# Altium project Wilamp_DCU.PrjPCB
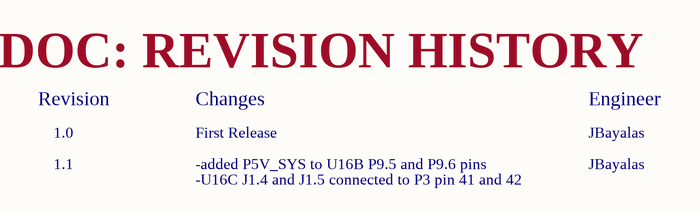
[diagram p0: revision_history.SchDoc]
7 sheets, 124 parts. Net scope: hierarchical (ports join the sheet entries above them; power ports are global).
Board file: wilamp_DCU.PcbDoc
Sheets:
  revision_history.SchDoc
  top_dsn.SchDoc
    JN1 = JN5168.SchDoc
    JN2 = JN5168.SchDoc
    crypto_blk = crypto_blk.SchDoc
    bbb_conn_blk = bbb_blk.SchDoc
    U_USB_Mini = USB_Mini.SchDoc
    U_pic_blk = pic_blk.SchDoc

## Sheet revision_history.SchDoc
size A4; Date: 10/27/2015; Engineer: JBayalas; DocumentNumber: 2; Revision: V1.1; SheetNumber: 2; SheetTotal: 13

### Notes on the sheet
- Revision
- Changes
- DOC: REVISION HISTORY
- Engineer
- 1.0
- 1.1
- First Release
- -added P5V_SYS to U16B P9.5 and P9.6 pins
- -U16C J1.4 and J1.5 connected to P3 pin 41 and 42
- JBayalas
- Title:
- Sheet:
- Date:
- of
- Project:
- Revision:
- Engineer:
- Wi4B S.r.l

## Sheet top_dsn.SchDoc
size A4; Date: 1/11/16; Engineer: JBayalas; DocumentNumber: 3; Revision: V1.1; SheetNumber: 3; SheetTotal: 13
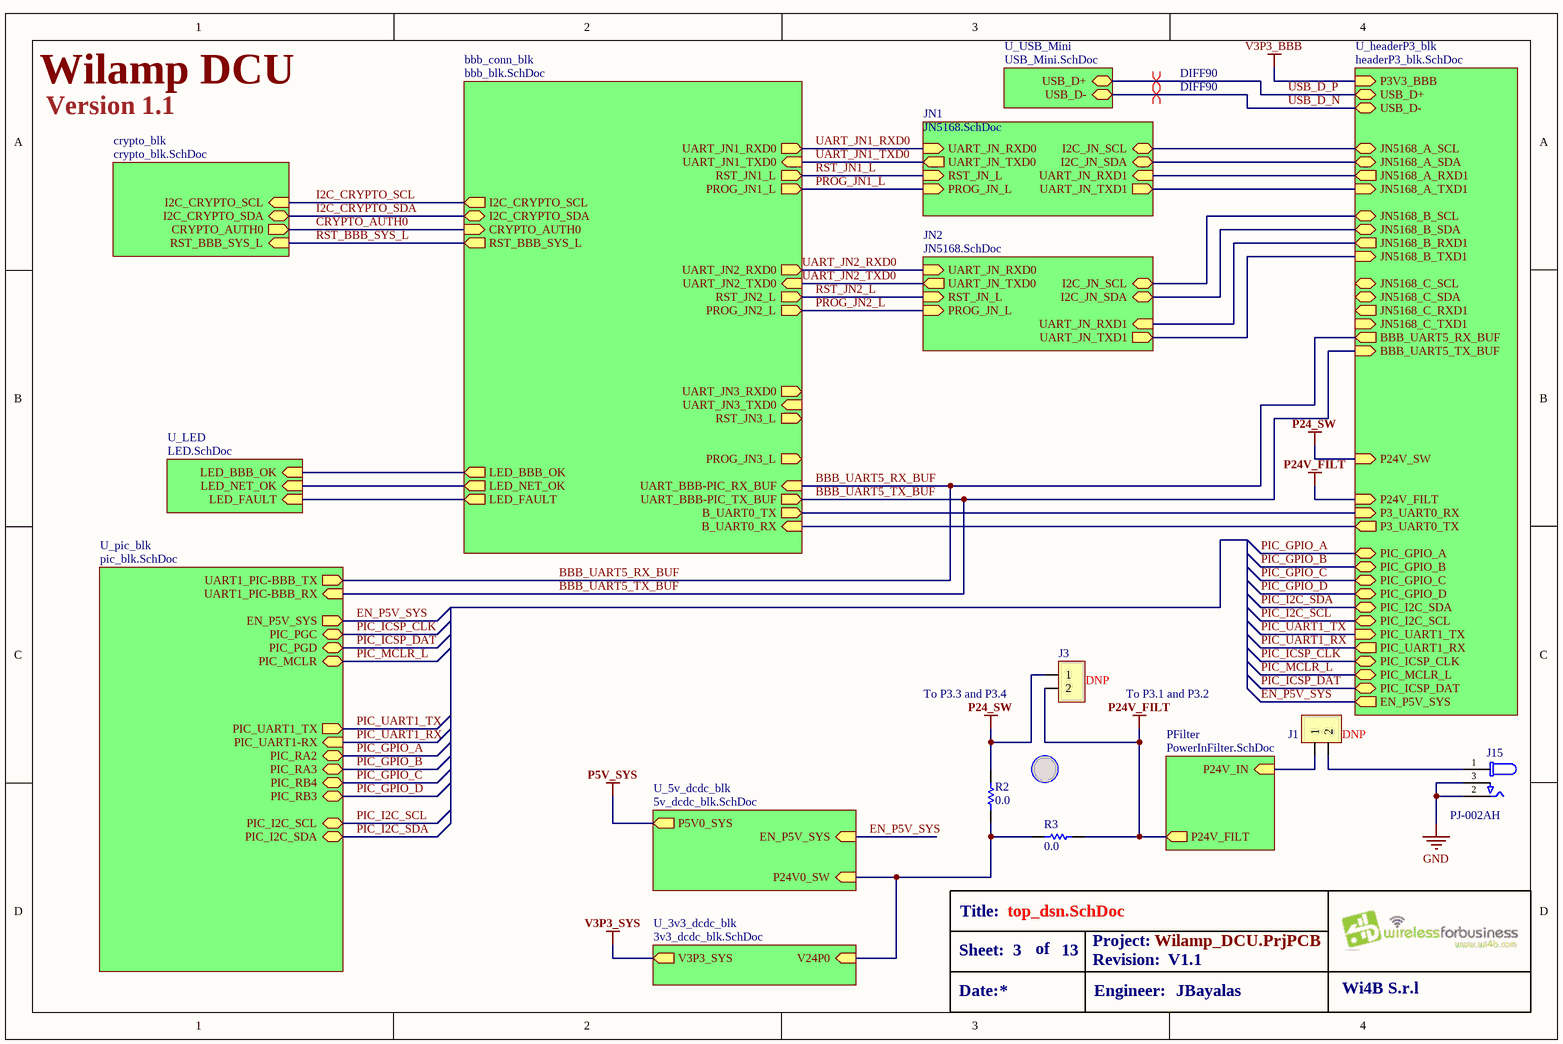
[diagram p1: top_dsn.SchDoc]

### Parts
J1  LOAD: DNP  [2pin 5mm Pitch]  (hidden comment: *)
J3  LOAD: DNP  [2pin 5mm Pitch]  (hidden comment: *)
J15  *  [PJ-002AH]  (value not drawn)
R2  value 0.0  [R0805]  (hidden comment: *)
R3  value 0.0  [R0805]  (hidden comment: *)

### Sub-sheets
bbb_conn_blk = bbb_blk.SchDoc: I2C_CRYPTO_SCL (out), I2C_CRYPTO_SDA (bidir), CRYPTO_AUTH0 (in), RST_BBB_SYS_L (out), UART_JN1_TXD0 (in), UART_JN1_RXD0 (out), UART_JN2_TXD0 (in), UART_JN2_RXD0 (out), UART_JN3_TXD0 (in), UART_JN3_RXD0 (out), LED_NET_OK (out), LED_BBB_OK (out), LED_FAULT (out), RST_JN1_L (out), RST_JN2_L (out), RST_JN3_L (out), PROG_JN1_L (out), PROG_JN2_L (out), PROG_JN3_L (out), UART_BBB-PIC_RX_BUF (in), UART_BBB-PIC_TX_BUF (out), B_UART0_RX (in), B_UART0_TX (out)
crypto_blk = crypto_blk.SchDoc: I2C_CRYPTO_SCL (in), I2C_CRYPTO_SDA (bidir), CRYPTO_AUTH0 (out), RST_BBB_SYS_L (in)
JN1 = JN5168.SchDoc: UART_JN_TXD0 (out), UART_JN_RXD0 (in), I2C_JN_SDA (bidir), I2C_JN_SCL (bidir), RST_JN_L (in), PROG_JN_L (in), UART_JN_TXD1 (out), UART_JN_RXD1 (in)
JN2 = JN5168.SchDoc: UART_JN_TXD0 (out), UART_JN_RXD0 (in), I2C_JN_SDA (bidir), I2C_JN_SCL (bidir), RST_JN_L (in), PROG_JN_L (in), UART_JN_TXD1 (out), UART_JN_RXD1 (in)
PFilter = PowerInFilter.SchDoc (file not in this document): P24V_FILT (out), P24V_IN (in)
U_3v3_dcdc_blk = 3v3_dcdc_blk.SchDoc (file not in this document): V3P3_SYS (out), V24P0 (in)
U_5v_dcdc_blk = 5v_dcdc_blk.SchDoc (file not in this document): P5V0_SYS (out), P24V0_SW (in), EN_P5V_SYS (in)
U_headerP3_blk = headerP3_blk.SchDoc (file not in this document): P3V3_BBB (in), PIC_ICSP_DAT (bidir), PIC_UART1_RX (out), BBB_UART5_TX_BUF (in), PIC_I2C_SDA (bidir), PIC_GPIO_B (bidir), PIC_GPIO_D (bidir), JN5168_A_RXD1 (out), JN5168_A_SDA (bidir), JN5168_B_RXD1 (out), JN5168_B_SDA (bidir), JN5168_C_RXD1 (out), JN5168_C_SDA (bidir), USB_D- (bidir), EN_P5V_SYS (out), PIC_ICSP_CLK (bidir), PIC_UART1_TX (in), BBB_UART5_RX_BUF (out), PIC_I2C_SCL (bidir), PIC_GPIO_A (bidir), PIC_GPIO_C (bidir), JN5168_A_TXD1 (in), JN5168_A_SCL (bidir), JN5168_B_TXD1 (in), JN5168_B_SCL (bidir), JN5168_C_TXD1 (in), JN5168_C_SCL (bidir), USB_D+ (bidir), PIC_MCLR_L (bidir), P24V_FILT (in), P24V_SW (in), P3_UART0_RX (in), P3_UART0_TX (out)
U_LED = LED.SchDoc (file not in this document): LED_BBB_OK (in), LED_NET_OK (in), LED_FAULT (in)
U_pic_blk = pic_blk.SchDoc: PIC_I2C_SCL (bidir), PIC_I2C_SDA (bidir), PIC_PGD (bidir), PIC_PGC (bidir), PIC_MCLR (bidir), PIC_RA2 (bidir), PIC_RA3 (bidir), UART1_PIC-BBB_RX (in), UART1_PIC-BBB_TX (out), PIC_UART1_TX (out), PIC_UART1-RX (in), EN_P5V_SYS (out), PIC_RB3 (bidir), PIC_RB4 (bidir)
U_USB_Mini = USB_Mini.SchDoc: USB_D+ (bidir), USB_D- (bidir)

### Nets
GND: J15.2 J15.3
P24_SW: J3.1 R2.2 ; sheet U_headerP3_blk/P24V_SW
P24V_FILT: J3.2 R3.2 ; sheet PFilter/P24V_FILT, sheet U_headerP3_blk/P24V_FILT
B_UART0_RX: sheet bbb_conn_blk/B_UART0_RX, sheet U_headerP3_blk/P3_UART0_TX
B_UART0_TX: sheet bbb_conn_blk/B_UART0_TX, sheet U_headerP3_blk/P3_UART0_RX
BBB_UART5_RX_BUF: sheet bbb_conn_blk/UART_BBB-PIC_RX_BUF, sheet U_headerP3_blk/BBB_UART5_RX_BUF, sheet U_pic_blk/UART1_PIC-BBB_TX
BBB_UART5_TX_BUF: sheet bbb_conn_blk/UART_BBB-PIC_TX_BUF, sheet U_headerP3_blk/BBB_UART5_TX_BUF, sheet U_pic_blk/UART1_PIC-BBB_RX
CRYPTO_AUTH0: sheet crypto_blk/CRYPTO_AUTH0, sheet bbb_conn_blk/CRYPTO_AUTH0
EN_P5V_SYS: sheet U_5v_dcdc_blk/EN_P5V_SYS, sheet U_headerP3_blk/EN_P5V_SYS, sheet U_pic_blk/EN_P5V_SYS
I2C_CRYPTO_SCL: sheet crypto_blk/I2C_CRYPTO_SCL, sheet bbb_conn_blk/I2C_CRYPTO_SCL
I2C_CRYPTO_SDA: sheet crypto_blk/I2C_CRYPTO_SDA, sheet bbb_conn_blk/I2C_CRYPTO_SDA
I2C_JN_SCL_JN1: sheet JN1/I2C_JN_SCL, sheet U_headerP3_blk/JN5168_A_SCL
I2C_JN_SCL_JN2: sheet JN2/I2C_JN_SCL, sheet U_headerP3_blk/JN5168_B_SCL
I2C_JN_SDA_JN1: sheet JN1/I2C_JN_SDA, sheet U_headerP3_blk/JN5168_A_SDA
I2C_JN_SDA_JN2: sheet JN2/I2C_JN_SDA, sheet U_headerP3_blk/JN5168_B_SDA
PIC_GPIO_A: sheet U_headerP3_blk/PIC_GPIO_A, sheet U_pic_blk/PIC_RA2
PIC_GPIO_B: sheet U_headerP3_blk/PIC_GPIO_B, sheet U_pic_blk/PIC_RA3
PIC_GPIO_C: sheet U_headerP3_blk/PIC_GPIO_C, sheet U_pic_blk/PIC_RB4
PIC_GPIO_D: sheet U_headerP3_blk/PIC_GPIO_D, sheet U_pic_blk/PIC_RB3
PIC_I2C_SCL: sheet U_headerP3_blk/PIC_I2C_SCL, sheet U_pic_blk/PIC_I2C_SCL
PIC_I2C_SDA: sheet U_headerP3_blk/PIC_I2C_SDA, sheet U_pic_blk/PIC_I2C_SDA
PIC_ICSP_CLK: sheet U_headerP3_blk/PIC_ICSP_CLK, sheet U_pic_blk/PIC_PGC
PIC_ICSP_DAT: sheet U_headerP3_blk/PIC_ICSP_DAT, sheet U_pic_blk/PIC_PGD
PIC_MCLR_L: sheet U_headerP3_blk/PIC_MCLR_L, sheet U_pic_blk/PIC_MCLR  [project net PIC_MCLR]
PIC_UART1_RX: sheet U_headerP3_blk/PIC_UART1_RX, sheet U_pic_blk/PIC_UART1-RX
PIC_UART1_TX: sheet U_headerP3_blk/PIC_UART1_TX, sheet U_pic_blk/PIC_UART1_TX
PROG_JN1_L: sheet JN1/PROG_JN_L, sheet bbb_conn_blk/PROG_JN1_L
PROG_JN2_L: sheet JN2/PROG_JN_L, sheet bbb_conn_blk/PROG_JN2_L
RST_BBB_SYS_L: sheet crypto_blk/RST_BBB_SYS_L, sheet bbb_conn_blk/RST_BBB_SYS_L
RST_JN1_L: sheet JN1/RST_JN_L, sheet bbb_conn_blk/RST_JN1_L
RST_JN2_L: sheet JN2/RST_JN_L, sheet bbb_conn_blk/RST_JN2_L
UART_JN1_RXD0: sheet JN1/UART_JN_RXD0, sheet bbb_conn_blk/UART_JN1_RXD0
UART_JN1_TXD0: sheet JN1/UART_JN_TXD0, sheet bbb_conn_blk/UART_JN1_TXD0
UART_JN2_RXD0: sheet JN2/UART_JN_RXD0, sheet bbb_conn_blk/UART_JN2_RXD0
UART_JN2_TXD0: sheet JN2/UART_JN_TXD0, sheet bbb_conn_blk/UART_JN2_TXD0
USB_D_N: sheet U_USB_Mini/USB_D-, sheet U_headerP3_blk/USB_D-
USB_D_P: sheet U_USB_Mini/USB_D+, sheet U_headerP3_blk/USB_D+
NetJ1_1: J1.1 ; sheet PFilter/P24V_IN
NetJ1_2: J1.2 J15.1
NetR2_1: R2.1 R3.1 ; sheet U_5v_dcdc_blk/P24V0_SW, sheet U_3v3_dcdc_blk/V24P0
NetU22_5: sheet bbb_conn_blk/LED_FAULT, sheet U_LED/LED_FAULT
NetU22_7: sheet bbb_conn_blk/LED_NET_OK, sheet U_LED/LED_NET_OK
NetU22_9: sheet bbb_conn_blk/LED_BBB_OK, sheet U_LED/LED_BBB_OK
(unnamed): sheet JN1/UART_JN_TXD1, sheet U_headerP3_blk/JN5168_A_TXD1
(unnamed): sheet JN1/UART_JN_RXD1, sheet U_headerP3_blk/JN5168_A_RXD1
(unnamed): sheet JN2/UART_JN_TXD1, sheet U_headerP3_blk/JN5168_B_TXD1
(unnamed): sheet JN2/UART_JN_RXD1, sheet U_headerP3_blk/JN5168_B_RXD1

### Layout directives
differential pair; net class DIFF90: USB_D_N, USB_D_P

### Notes on the sheet
- Version 1.1
- Wilamp DCU
- (near J3) To P3.3 and P3.4
- To P3.1 and P3.2
- Title:
- Sheet:
- Date:
- of
- Project:
- Revision:
- Engineer:
- Wi4B S.r.l

### Library data of the parts
J1 J3 = 2PIN Signal 5mm Pitch: FUNCTION: TOP
J15 = PJ-002AH: CONN PWR JACK 2.1X5.5MM HIGH CUR; MFT: CUI Inc.; FUNCTION: TOP; VALUE: PJ-002AH; TYPE: TH; RATING: *; LOAD: *; MPN: PJ-002AH
R2 R3 = RC0805JR-070RL: RES SMD 0.0 OHM JUMPER 1/8W 0805; MFT: Yageo; FUNCTION: TOP; MPN: RC0805JR-070RL; TYPE: Surface Mount; RATING: 1/8W

## Sheet JN5168.SchDoc
size A4; Date: 1/11/2016; Engineer: JBayalas; DocumentNumber: 4; Revision: V1.1; SheetNumber: 4; SheetTotal: 13
Used 2 times, as channels JN1, JN2. Parts and nets are listed once, with the designators drawn on the sheet.
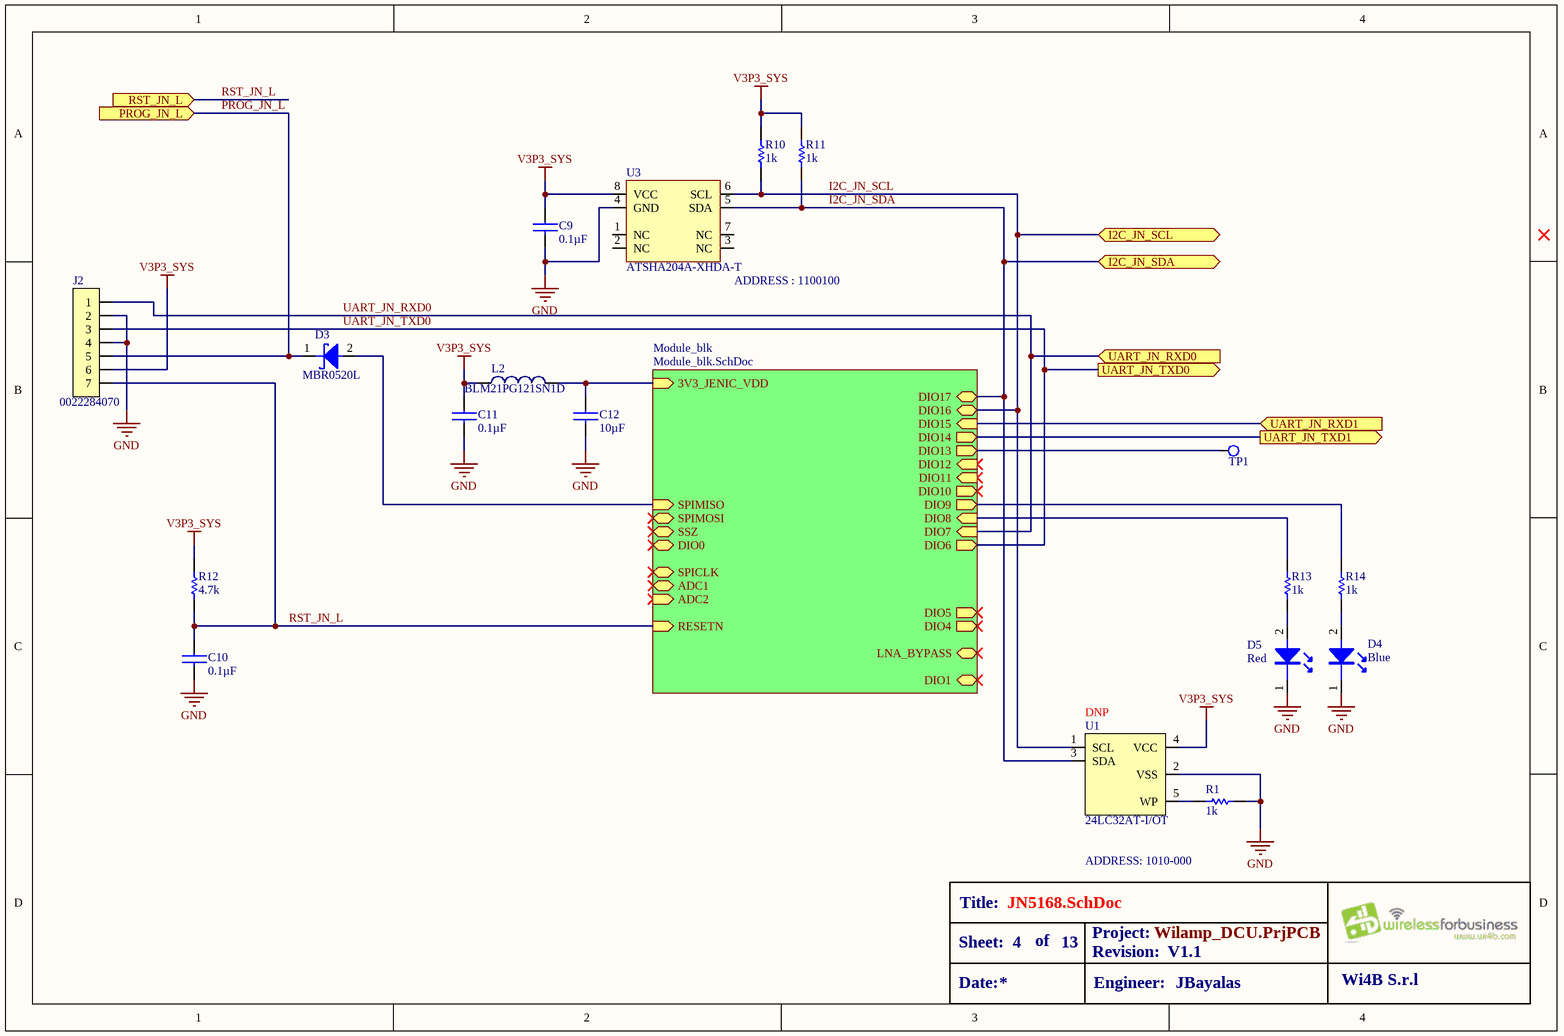
[diagram p2: JN5168.SchDoc]

### Parts
C9  value 0.1µF  [C0402]  (hidden comment: *)
C10  value 0.1µF  [C0402]  (hidden comment: *)
C11  value 0.1µF  [C0402]  (hidden comment: *)
C12  value 10µF  [C0805]  (hidden comment: *)
D3  MBR0520L  [SOD123]
D4  value Blue  [LED-0603 (BLUE)]  (hidden comment: *)
D5  value Red  [LED0805 - (RED)]  (hidden comment: *)
J2  *  [0022284070]  (value not drawn)
L2  *  [0805 INDUCTOR]  (value not drawn)
R1  value 1k  [R0402]  (hidden comment: *)
R10  value 1k  [R0402]  (hidden comment: *)
R11  value 1k  [R0402]  (hidden comment: *)
R12  value 4.7k  [R0603]  (hidden comment: *)
R13  value 1k  [R0603]  (hidden comment: *)
R14  value 1k  [R0603]  (hidden comment: *)
TP1  *  [Test Point 1.27mm]  (value not drawn)
U1  LOAD: DNP  [SOT-23-5]  (hidden comment: *)
U3  ATSHA204A-XHDA-T  [TSSOP-8 (wide Body)]

### Sub-sheets
Module_blk = Module_blk.SchDoc (file not in this document): ADC1 (bidir), SPICLK (bidir), SPIMISO (in), SPIMOSI (bidir), SSZ (bidir), DIO0 (bidir), DIO1 (bidir), LNA_BYPASS (bidir), 3V3_JENIC_VDD (in), DIO10 (out), DIO9 (out), DIO8 (in), DIO7 (in), DIO6 (out), DIO5 (out), DIO4 (out), DIO17 (bidir), DIO16 (bidir), DIO15 (in), DIO14 (out), RESETN (in), DIO13 (out), DIO12 (in), DIO11 (in), ADC2 (in)

### Ports
I2C_JN_SCL (bidir), I2C_JN_SDA (bidir), PROG_JN_L (in), RST_JN_L (in), UART_JN_RXD0 (in), UART_JN_RXD1 (in), UART_JN_TXD0 (out), UART_JN_TXD1 (out)

### Nets
GND: C9.2 C10.2 C11.2 C12.2 D4.1 D5.1 J2.2 J2.4 R1.2 U1.2(VSS) U3.4(GND)
V3P3_SYS: C9.1 C11.1 J2.6 L2.2 R10.2 R11.2 R12.2 U1.4(VCC) U3.8(VCC)
I2C_JN_SCL: R10.1 U1.1(SCL) U3.6(SCL) ; port I2C_JN_SCL, sheet Module_blk/DIO16
I2C_JN_SDA: R11.1 U1.3(SDA) U3.5(SDA) ; port I2C_JN_SDA, sheet Module_blk/DIO17
PROG_JN_L: D3.1(cathode) J2.5 ; port PROG_JN_L
RST_JN_L: C10.1 J2.7 R12.1 ; port RST_JN_L, sheet Module_blk/RESETN
UART_JN_RXD0: J2.1 ; port UART_JN_RXD0, sheet Module_blk/DIO7
UART_JN_RXD1: port UART_JN_RXD1, sheet Module_blk/DIO15
UART_JN_TXD0: J2.3 ; port UART_JN_TXD0, sheet Module_blk/DIO6
UART_JN_TXD1: port UART_JN_TXD1, sheet Module_blk/DIO14
NetC12_1: C12.1 L2.1 ; sheet Module_blk/3V3_JENIC_VDD
NetD3_2: D3.2(anode) ; sheet Module_blk/SPIMISO
NetD4_2: D4.2 R14.2
NetD5_2: D5.2 R13.2
NetR1_1: R1.1 U1.5(WP)
NetR13_1: R13.1 ; sheet Module_blk/DIO8
NetR14_1: R14.1 ; sheet Module_blk/DIO9
NetTP1_1: TP1.1 ; sheet Module_blk/DIO13

Not connected (* = marked no-connect by the designer): U3 1(NC) 2(NC) 3(NC) 7(NC)

### Channels
JN1: designators end in _JN1; ports I2C_JN_SCL=I2C_JN_SCL_JN1 I2C_JN_SDA=I2C_JN_SDA_JN1 PROG_JN_L=PROG_JN1_L RST_JN_L=RST_JN1_L UART_JN_RXD0=UART_JN1_RXD0 UART_JN_RXD1=open UART_JN_TXD0=UART_JN1_TXD0 UART_JN_TXD1=open
JN2: designators end in _JN2; ports I2C_JN_SCL=I2C_JN_SCL_JN2 I2C_JN_SDA=I2C_JN_SDA_JN2 PROG_JN_L=PROG_JN2_L RST_JN_L=RST_JN2_L UART_JN_RXD0=UART_JN2_RXD0 UART_JN_RXD1=open UART_JN_TXD0=UART_JN2_TXD0 UART_JN_TXD1=open

### Notes on the sheet
- (near U3) ADDRESS : 1100100
- ADDRESS: 1010-000
- Title:
- Sheet:
- Date:
- of
- Project:
- Revision:
- Engineer:
- Wi4B S.r.l

### Library data of the parts
C9-C11 = CL05B104KO3LNNC: CAP CER 0.1UF 16V X7R 0402; MFT: Samsung Electro-Mechanics America, Inc.; RATING: ±10%, 16V; TYPE: Surface Mount, MLCC; FUNCTION: JENNIC; MPN: CL05B104KO3LNNC
C12 = GRM219R60J106KE19D: CAP CER 10UF 6.3V X5R 0805; MFT: Murata Electronics North America; TYPE: Surface Mount, MLCC; FUNCTION: JENNIC; MPN: GRM219R60J106KE19D; RATING: 6.3V
D3 = MBR0520L: DIODE SCHOTTKY 20V 0.5A SOD123; MFT: ON Semiconductor; TYPE: SMD; RATING: 20V 500MA; FUNCTION: JENNIC; VALUE: MBR0520L; MPN: MBR0520L
D4 = LTST-C191TBKT: LED BLUE CLEAR 0603 SMD; MFT: Lite-On Inc.; TYPE: Surface Mount; FUNCTION: JENNIC; MPN: LTST-C191TBKT
D5 = LS R976-NR-1: LED CHIPLED 633NM RED 0805 SMD; MFT: OSRAM Opto Semiconductors Inc.; FUNCTION: JENNIC; MPN: LS R976-NR-1
J2 = 0022284070: CONN HEADER 7POS .100 VERT TIN; MFT: Molex, LLC; FUNCTION: JENNIC; VALUE: 0022284070; TYPE: TH; RATING: *; MPN: 0022284070
L2 = BLM21PG121SN1D: FERRITE CHIP 120 OHM 0805; MFT: Murata Electronics North America; RATING: 3A; TYPE: Surface Mount; VALUE: 120 Ohm; FUNCTION: JENNIC; MPN: BLM21PG121SN1D
R1 R10 R11 = MCS04020C1001FE000: RES SMD 1K OHM 1% 1/10W 0402; MFT: Vishay Beyschlag; FUNCTION: JENNIC; MPN: MCS04020C1001FE000; TYPE: SMD; RATING: 1/10W; LOAD: *
R12 = ERA-3AEB472V: RES SMD 4.7K OHM 0.1% 1/10W 0603; MFT: Panasonic; FUNCTION: JENNIC; MPN: ERA-3AEB472V; LOAD: *; RATING: 1/10W; TYPE: SMD
R13 R14 = ERJ-3EKF1001V: RES SMD 1K OHM 1% 1/10W 0603; MFT: Panasonic Electronic Components; RATING: 0.1W; FUNCTION: JENNIC; MPN: ERJ-3EKF1001V; TYPE: Surface Mount
TP1 = Test Point: Test Point 1.27mm; FUNCTION: JENNIC
U1 = 24LC32AT-I/OT: IC EEPROM 32KBIT 400KHZ SOT23-5; MFT: Microchip Technology; FUNCTION: JENNIC; VALUE: 24LC32AT-I/OT; TYPE: SMD; RATING: *; MPN: 24LC32AT-I/OT
U3 = ATSHA204A-XHDA-T: IC CRYPTO 4.5KB I2C; MFT: Microchip Technology; FUNCTION: JENNIC; LOAD: *; TYPE: SMD; VALUE: ATSHA204A-XHDA-T; RATING: *; MPN: ATSHA204A-XHDA-T

## Sheet crypto_blk.SchDoc
size A4; Engineer: JBayalas; DocumentNumber: 5; Revision: V1.1; SheetNumber: 5; SheetTotal: 13
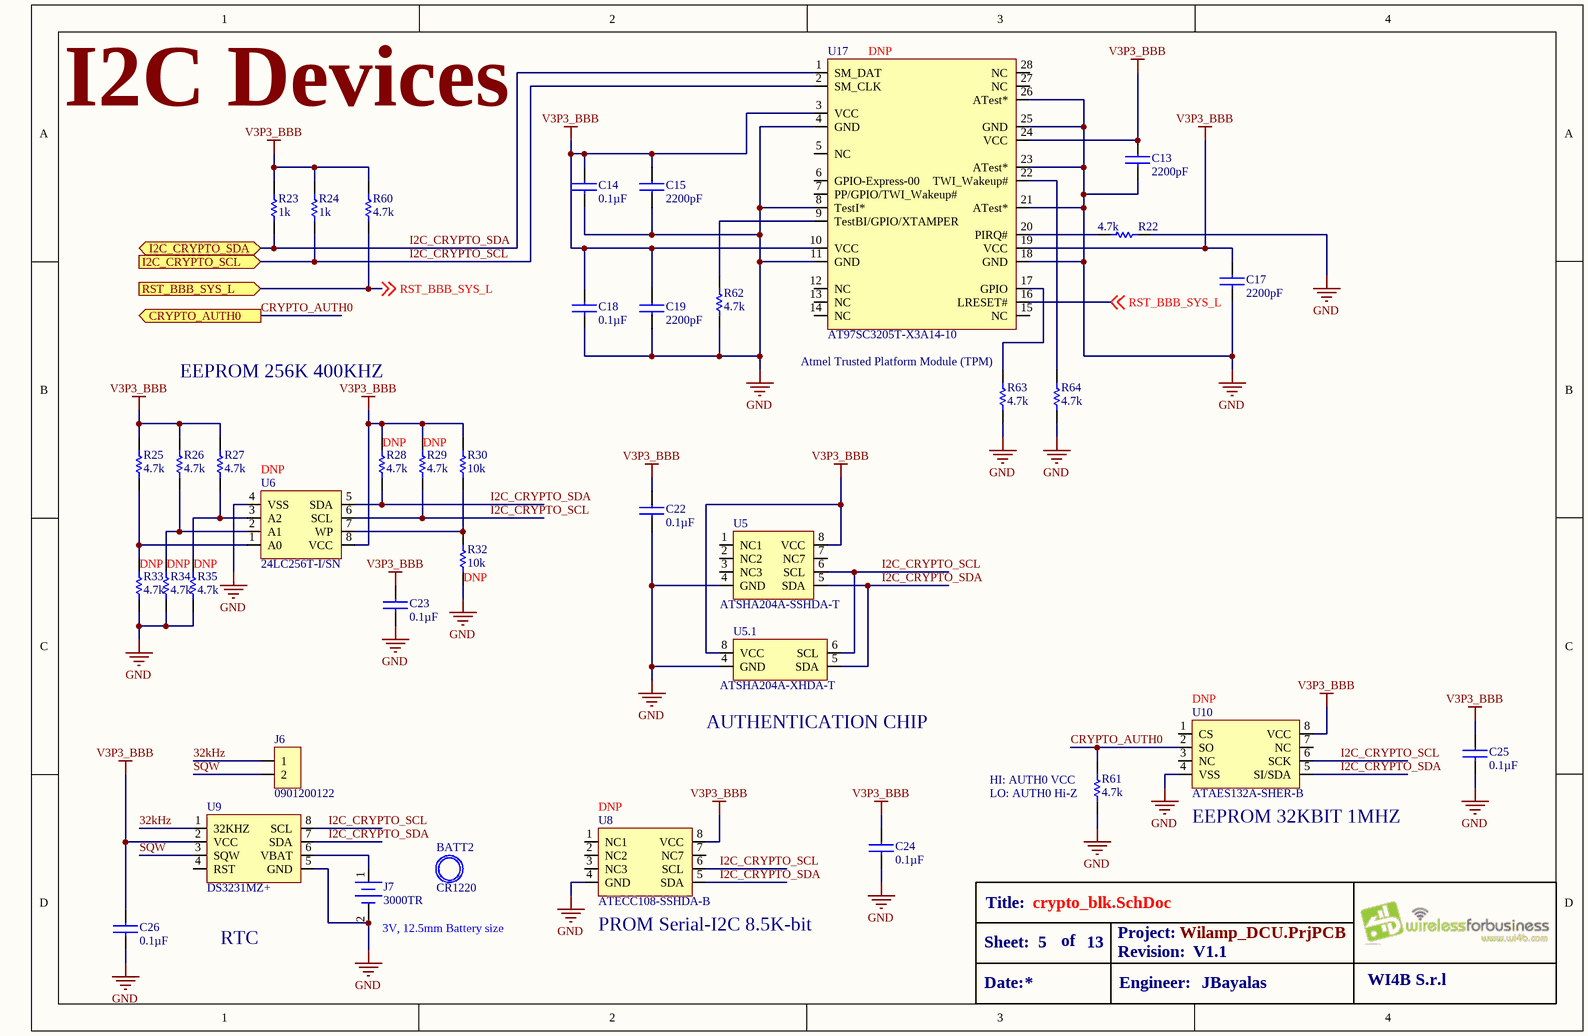
[diagram p3: crypto_blk.SchDoc]

### Parts
BATT2  CR1220
C13  value 2200pF  [C0805]  (hidden comment: *)
C14  value 0.1µF  [C0402]  (hidden comment: *)
C15  value 2200pF  [C0805]  (hidden comment: *)
C17  value 2200pF  [C0603]  (hidden comment: *)
C18  value 0.1µF  [C0402]  (hidden comment: *)
C19  value 2200pF  [C0805]  (hidden comment: *)
C22  value 0.1µF  [C0402]  (hidden comment: *)
C23  value 0.1µF  [C0402]  (hidden comment: *)
C24  value 0.1µF  [C0402]  (hidden comment: *)
C25  value 0.1µF  [C0402]  (hidden comment: *)
C26  value 0.1µF  [C0402]  (hidden comment: *)
J6  *  [0901200122]  (value not drawn)
J7  3000TR  [3000TR]
R22  value 4.7k  [R0402]  (hidden comment: RC0402JR-074K7L)
R23  value 1k  [R0402]  (hidden comment: *)
R24  value 1k  [R0402]  (hidden comment: *)
R25  value 4.7k  [R0402]  (hidden comment: *)
R26  value 4.7k  [R0402]  (hidden comment: *)
R27  value 4.7k  [R0402]  (hidden comment: *)
R28  value 4.7k  LOAD: DNP  [R0402]  (hidden comment: *)
R29  value 4.7k  LOAD: DNP  [R0402]  (hidden comment: *)
R30  value 10k  [R0402]  (hidden comment: *)
R32  value 10k  LOAD: DNP  [R0402]  (hidden comment: *)
R33  value 4.7k  LOAD: DNP  [R0402]  (hidden comment: *)
R34  value 4.7k  LOAD: DNP  [R0402]  (hidden comment: *)
R35  value 4.7k  LOAD: DNP  [R0402]  (hidden comment: *)
R60  value 4.7k  [R0402]  (hidden comment: *)
R61  value 4.7k  [R0402]  (hidden comment: *)
R62  value 4.7k  [R0402]  (hidden comment: RC0402JR-074K7L)
R63  value 4.7k  [R0402]  (hidden comment: RC0402JR-074K7L)
R64  value 4.7k  [R0402]  (hidden comment: RC0402JR-074K7L)
U5  value ATSHA204A-SSHDA-T  [SOIC-8]  (hidden comment: *)
U5.1  ATSHA204A-XHDA-T  [TSSOP-8 (wide Body)]
U6  value 24LC256T-I/SN  LOAD: DNP  [SOIC-8]  (hidden comment: *)
U8  value ATECC108-SSHDA-B  LOAD: DNP  [SOIC-8]  (hidden comment: *)
U9  value DS3231MZ+  [SOIC-8]  (hidden comment: *)
U10  LOAD: DNP  [SOIC-8]  (hidden comment: ATAES132A-SHER-B)
U17  LOAD: DNP  [TSSOP-28]  (hidden comment: AT97SC3205T-X3A14-10)

### Ports
CRYPTO_AUTH0 (out), I2C_CRYPTO_SCL (in), I2C_CRYPTO_SDA (bidir), RST_BBB_SYS_L (in)

### Nets
GND: C13.2 C14.2 C15.2 C17.2 C18.2 C19.2 C22.2 C23.2 C24.2 C25.2 C26.2 J7.2(-) R22.1 R32.1 R33.1 R34.1 R35.1 R61.1 R62.1 R63.1 R64.1 U5.4(GND) U5.1.4(GND) U6.4(VSS) U8.4(GND) U9.5(GND) U10.4(VSS) U17.4(GND) U17.8(TestI*) U17.11(GND) U17.18(GND) U17.21(ATest*) U17.23(ATest*) U17.25(GND) U17.26(ATest*)
V3P3_BBB: C13.1 C14.1 C15.1 C17.1 C18.1 C19.1 C22.1 C23.1 C24.1 C25.1 C26.1 R23.1 R24.1 R25.2 R26.2 R27.2 R28.2 R29.2 R30.2 R60.2 U5.8(VCC) U5.1.8(VCC) U6.8(VCC) U8.8(VCC) U9.2(VCC) U10.8(VCC) U17.3(VCC) U17.10(VCC) U17.19(VCC) U17.24(VCC)
32kHz: J6.1 U9.1(32KHZ)
CRYPTO_AUTH0: R61.2 U10.2(SO) ; port CRYPTO_AUTH0
I2C_CRYPTO_SCL: R24.2 R29.1 U5.6(SCL) U5.1.6(SCL) U6.6(SCL) U8.6(SCL) U9.8(SCL) U10.6(SCK) U17.2(SM_CLK) ; port I2C_CRYPTO_SCL
I2C_CRYPTO_SDA: R23.2 R28.1 U5.5(SDA) U5.1.5(SDA) U6.5(SDA) U8.5(SDA) U9.7(SDA) U10.5(SI/SDA) U17.1(SM_DAT) ; port I2C_CRYPTO_SDA
RST_BBB_SYS_L: R60.1 U17.16(LRESET#) ; off-sheet RST_BBB_SYS_L, port RST_BBB_SYS_L
SQW: J6.2 U9.3(SQW)
NetJ7_1: J7.1(+) U9.6(VBAT)
NetR22_2: R22.2 U17.20(PIRQ#)
NetR25_1: R25.1 R33.2 U6.1(A0)
NetR26_1: R26.1 R34.2 U6.2(A1)
NetR27_1: R27.1 R35.2 U6.3(A2)
NetR30_1: R30.1 R32.2 U6.7(WP)
NetR62_2: R62.2 U17.9(TestBI/GPIO/XTAMPER)
NetR63_2: R63.2 U17.17(GPIO)
NetR64_2: R64.2 U17.22(TWI_Wakeup#)

Not connected (* = marked no-connect by the designer): U5 1(NC1) 2(NC2) 3(NC3) 7(NC7); U8 1(NC1) 2(NC2) 3(NC3) 7(NC7); U9 4(RST); U10 1(CS) 3(NC) 7(NC); U17 5(NC) 6(GPIO-Express-00) 7(PP/GPIO/TWI_Wakeup#) 12(NC) 13(NC) 14(NC) 15(NC) 27(NC) 28(NC)

### Notes on the sheet
- I2C Devices
- EEPROM 256K 400KHZ
- (near R63) Atmel Trusted Platform Module (TPM)
- (near U5.1) AUTHENTICATION CHIP
- (near R61) HI: AUTH0 VCC
- (near R61) LO: AUTH0 Hi-Z
- (near U10) EEPROM 32KBIT 1MHZ
- RTC
- (near J7) 3V, 12.5mm Battery size
- (near U8) PROM Serial-I2C 8.5K-bit
- Title:
- Sheet:
- Date:
- of
- Project:
- Revision:
- Engineer:
- WI4B S.r.l

### Library data of the parts
BATT2 = CR1220: Coin Cell Battery 35mAh 12.5mm; MFT: FDK; RATING: 3V, 35mAh; FUNCTION: CRYPTO; TYPE: SMD; LOAD: *; VALUE: CR1220; MPN: CR1220
C13 C15 C19 = 08055C222KAT2A: CAP CER 2200PF 50V 10% X7R 0805; MFT: AVX Corporation; TYPE: Surface Mount, MLCC; FUNCTION: CRYPTO; MPN: 08055C222KAT2A; RATING: 50V 10% X7R
C14 C18 C22-C26 = CL05B104KO3LNNC: CAP CER 0.1UF 16V X7R 0402; MFT: Samsung Electro-Mechanics America, Inc.; RATING: ±10%, 16V; TYPE: Surface Mount, MLCC; FUNCTION: CRYPTO; MPN: CL05B104KO3LNNC
C17 = C0603C222K5RACTU: CAP CER 2200PF 50V X7R 0603; MFT: KEMET; TYPE: SMD; FUNCTION: CRYPTO; MPN: C0603C222K5RACTU; LOAD: *; RATING: 50V
J6 = 0901200122: CONN HEADER 2POS .100" STR TIN; MFT: Molex, LLC; FUNCTION: CRYPTO; TYPE: Through Hole; VALUE: 0901200122; MPN: 0901200122
J7 = 3000TR: Coin Cell Battery Holders SM COIN CELL B/H; MFT: Keystone Electronics; FUNCTION: CRYPTO; MPN: 3000TR; TYPE: SMD; RATING: *; LOAD: *; VALUE: 3000TR
R22 R25-R29 R33-R35 R60-R64 = RC0402JR-074K7L: RES SMD 4.7K OHM 5% 1/16W 0402; MFT: Yageo; FUNCTION: CRYPTO; MPN: RC0402JR-074K7L; RATING: ±5%; TYPE: Surface Mount
R23 R24 = MCS04020C1001FE000: RES SMD 1K OHM 1% 1/10W 0402; MFT: Vishay Beyschlag; FUNCTION: CRYPTO; MPN: MCS04020C1001FE000; TYPE: SMD; RATING: 1/10W; LOAD: *
R30 R32 = CRCW040210K0FKEDHP: RES SMD 10K OHM 1% 1/5W 0402; MFT: Vishay Dale; RATING: 0.2W, 1/5W; FUNCTION: CRYPTO; MPN: CRCW040210K0FKEDHP; TYPE: Surface Mount
U5 = ATSHA204A-SSHDA-T: IC AUTHENTICATION CHIP 8SOIC; MFT: Microchip Technology; FUNCTION: CRYPTO; MPN: ATSHA204A-SSHDA-T; LOAD: *; RATING: *; TYPE: SMD
U5.1 = ATSHA204A-XHDA-T: IC CRYPTO 4.5KB I2C; MFT: Microchip Technology; LOAD: *; TYPE: SMD; VALUE: ATSHA204A-XHDA-T; RATING: *; MPN: ATSHA204A-XHDA-T
U6 = 24LC256T-I/SN: IC EEPROM 256K I2C 400KHZ 8SOIC; MFT: Microchip Technology; FUNCTION: CRYPTO; RATING: *; TYPE: SMD; MPN: 24LC256T-I/SN
U8 = ATECC108-SSHDA-B: EEPROM Serial-I2C 8.5K-bit 2.5V/3.3V/5V 8-Pin SOIC Bulk; MFT: Microchip / Atmel; FUNCTION: CRYPTO; MPN: ATECC108-SSHDA-B; TYPE: SMD; RATING: 2.5V/3.3V/5V
U9 = DS3231MZ+: IC RTC I2C 8SOIC; MFT: Maxim; FUNCTION: CRYPTO; MPN: DS3231MZ+; TYPE: SMD; RATING: *; LOAD: *
U10 = ATAES132A-SHER-B: IC EEPROM 32KBIT 1MHZ 8SOIC; MFT: Microchip; FUNCTION: CRYPTO; MPN: ATAES132A-SHER-B; RATING: *; TYPE: SMD; VALUE: ATAES132A-SHER-B
U17 = AT97SC3205T-X3A14-10: STD COM 12C TPM 4.4 MM TSSOP UEK; MFT: Microchip / Atmel; FUNCTION: CRYPTO; MPN: AT97SC3205T-X3A14-10; TYPE: SMD; RATING: *; VALUE: AT97SC3205T-X3A14-10

## Sheet bbb_blk.SchDoc
size A4; Engineer: JBayalas; DocumentNumber: 6; Revision: V1.1; SheetNumber: 6; SheetTotal: 13
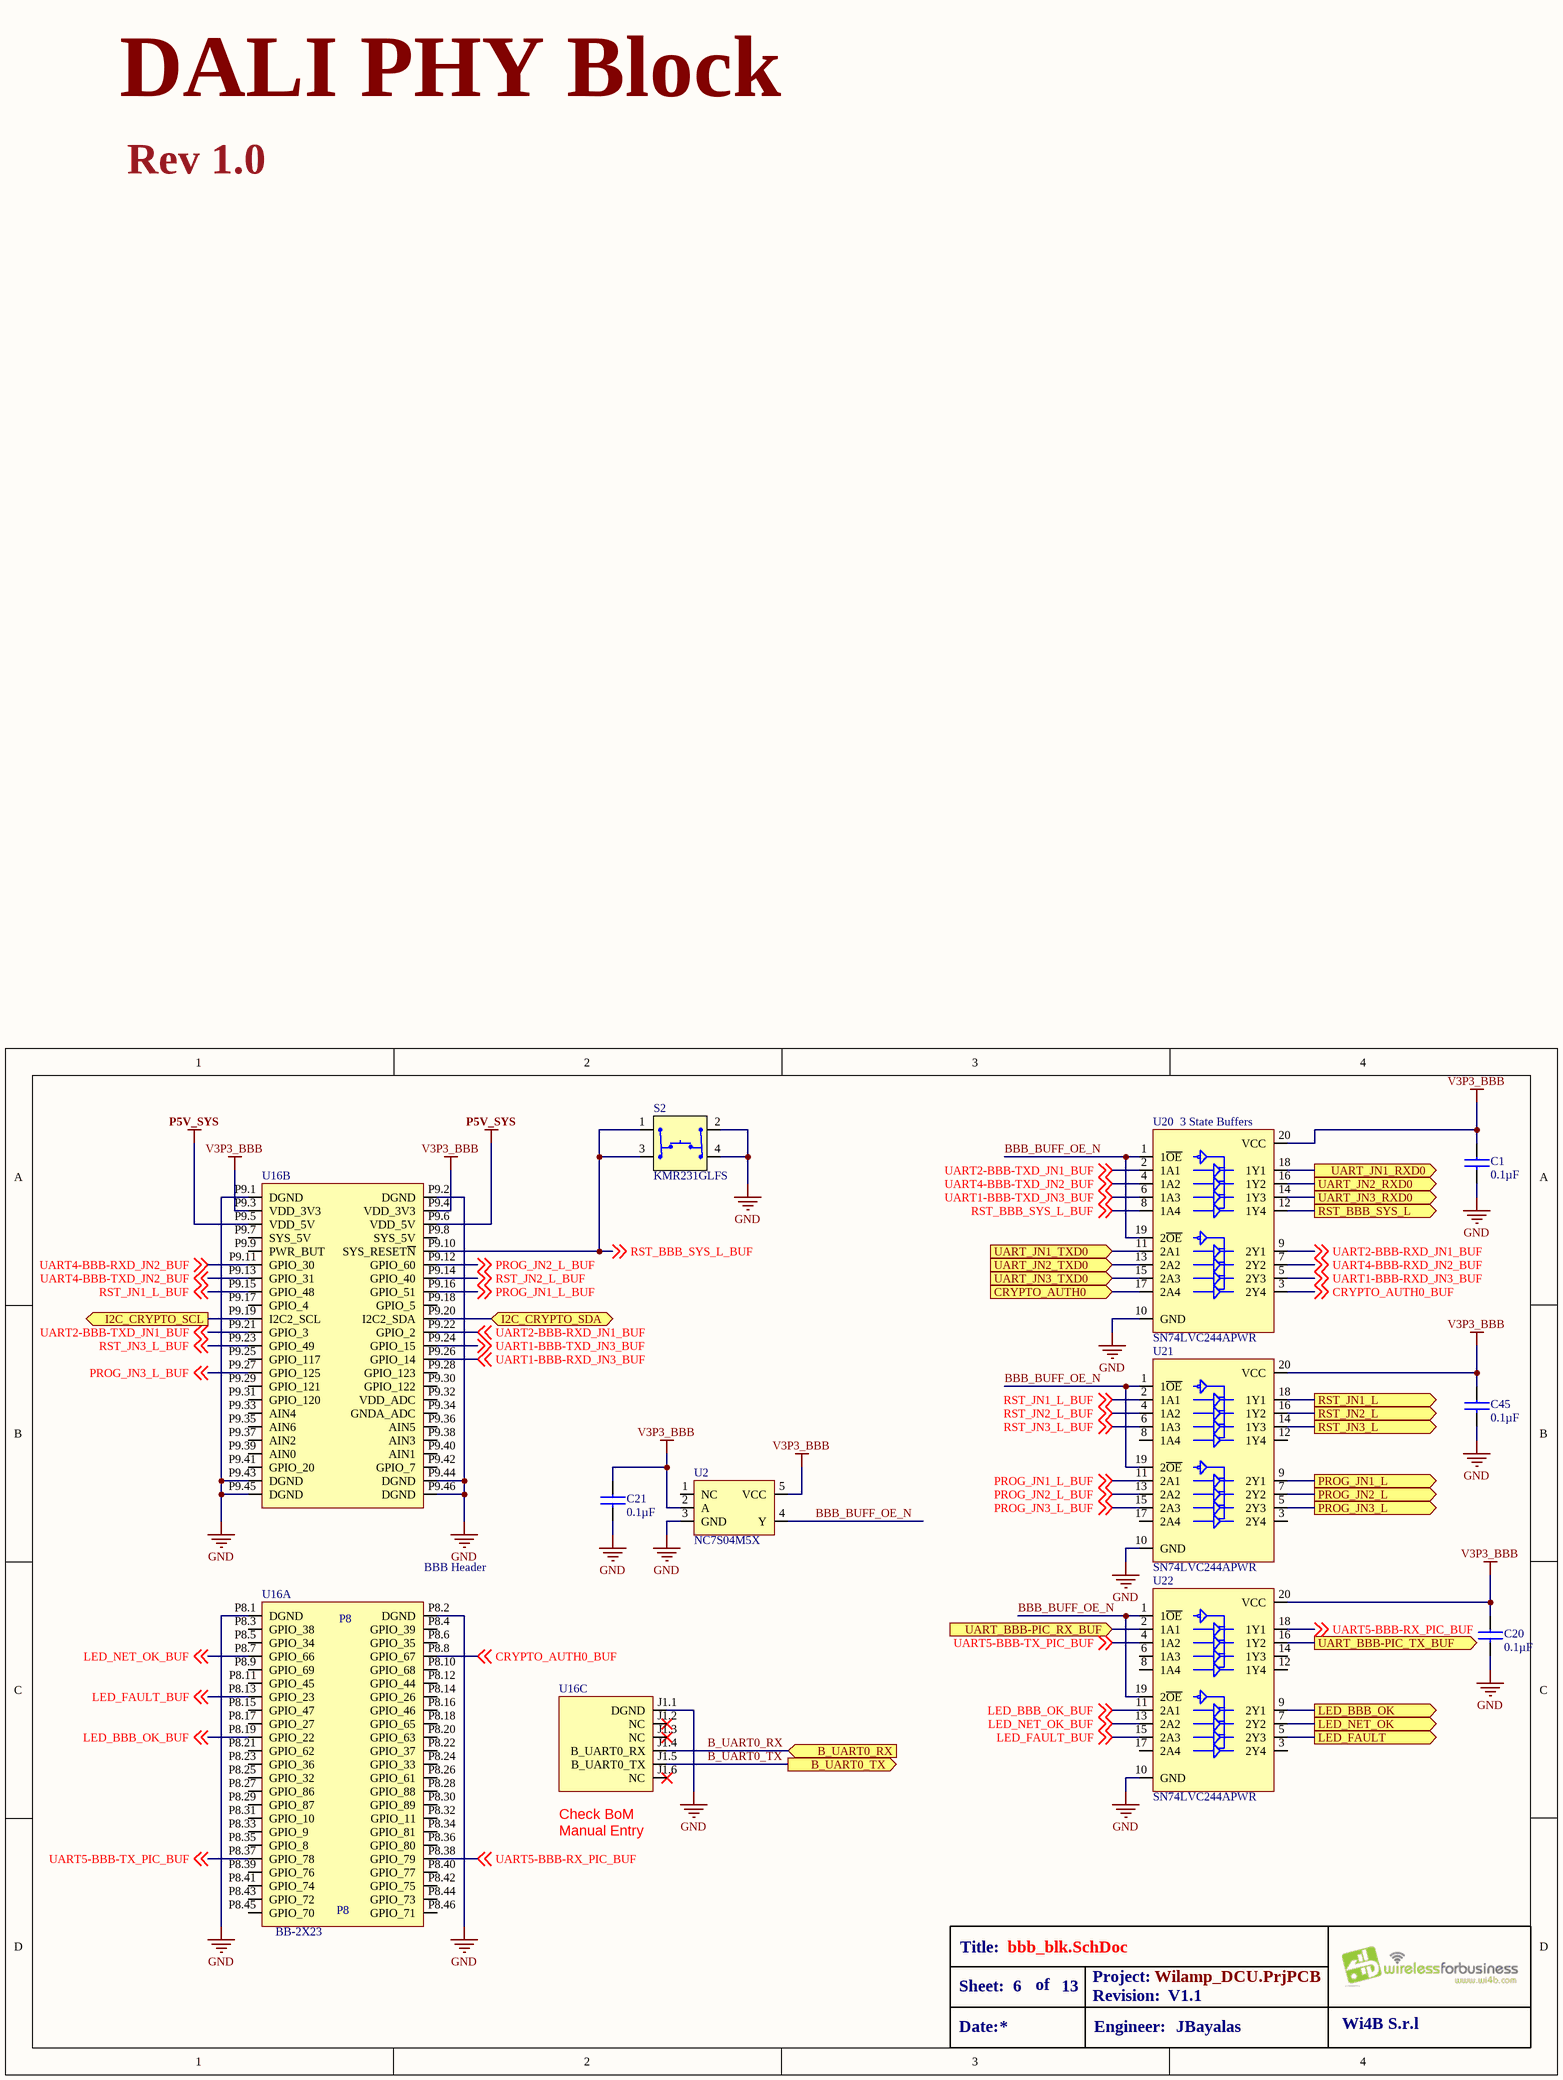
[diagram p4: bbb_blk.SchDoc]

### Parts
C1  value 0.1µF  [C0402]  (hidden comment: *)
C20  value 0.1µF  [C0402]  (hidden comment: *)
C21  value 0.1µF  [C0402]  (hidden comment: *)
C45  value 0.1µF  [C0402]  (hidden comment: *)
S2  *  [KMR231G ULC LFS]  (value not drawn)
U2  *  [SOT 23-5]  (value not drawn)
U16  MPN: BB-2X23  [BEAGLE_BONE_BLACK_CAPE]  (hidden comment: BEAGLE_BONE_BLACK_CAPE)  (parts A,B,C of 3)
U20  SN74LVC244APWR  [TSSOP-20 (SN74LVC)]
U21  SN74LVC244APWR  [TSSOP-20 (SN74LVC)]
U22  SN74LVC244APWR  [TSSOP-20 (SN74LVC)]

### Ports
B_UART0_RX (in), B_UART0_TX (out), CRYPTO_AUTH0 (in), I2C_CRYPTO_SCL (out), I2C_CRYPTO_SDA (bidir), LED_BBB_OK (out), LED_FAULT (out), LED_NET_OK (out), PROG_JN1_L (out), PROG_JN2_L (out), PROG_JN3_L (out), RST_BBB_SYS_L (out), RST_JN1_L (out), RST_JN2_L (out), RST_JN3_L (out), UART_BBB-PIC_RX_BUF (in), UART_BBB-PIC_TX_BUF (out), UART_JN1_RXD0 (out), UART_JN1_TXD0 (in), UART_JN2_RXD0 (out), UART_JN2_TXD0 (in), UART_JN3_RXD0 (out), UART_JN3_TXD0 (in)

### Nets
GND: C1.2 C20.2 C21.2 C45.2 S2.2 S2.4 U2.3(GND) U16.J1.1(DGND) U16.P8.1(DGND) U16.P8.2(DGND) U16.P9.1(DGND) U16.P9.2(DGND) U16.P9.43(DGND) U16.P9.44(DGND) U16.P9.45(DGND) U16.P9.46(DGND) U20.10(GND) U21.10(GND) U22.10(GND)
P5V_SYS: U16.P9.5(VDD_5V) U16.P9.6(VDD_5V)
V3P3_BBB: C1.1 C20.1 C21.1 C45.1 U2.2(A) U2.5(VCC) U16.P9.3(VDD_3V3) U16.P9.4(VDD_3V3) U20.20(VCC) U21.20(VCC) U22.20(VCC)
B_UART0_RX: U16.J1.4(B_UART0_RX) ; port B_UART0_RX
B_UART0_TX: U16.J1.5(B_UART0_TX) ; port B_UART0_TX
BBB_BUFF_OE_N: U2.4(Y) U20.1(1~{OE}) U20.19(2~{OE}) U21.1(1~{OE}) U21.19(2~{OE}) U22.1(1~{OE}) U22.19(2~{OE})
BBB_UART5_RX_BUF: U22.2(1A1) ; port UART_BBB-PIC_RX_BUF
BBB_UART5_TX_BUF: U22.16(1Y2) ; port UART_BBB-PIC_TX_BUF
CRYPTO_AUTH0: U20.17(2A4) ; port CRYPTO_AUTH0
CRYPTO_AUTH0_BUF: U16.P8.8(GPIO_67) U20.3(2Y4) ; off-sheet CRYPTO_AUTH0_BUF
I2C_CRYPTO_SCL: U16.P9.19(I2C2_SCL) ; port I2C_CRYPTO_SCL
I2C_CRYPTO_SDA: U16.P9.20(I2C2_SDA) ; port I2C_CRYPTO_SDA
LED_BBB_OK_BUF: U16.P8.19(GPIO_22) U22.11(2A1) ; off-sheet LED_BBB_OK_BUF
LED_FAULT_BUF: U16.P8.13(GPIO_23) U22.15(2A3) ; off-sheet LED_FAULT_BUF
LED_NET_OK_BUF: U16.P8.7(GPIO_66) U22.13(2A2) ; off-sheet LED_NET_OK_BUF
PROG_JN1_L: U21.9(2Y1) ; port PROG_JN1_L
PROG_JN1_L_BUF: U16.P9.16(GPIO_51) U21.11(2A1) ; off-sheet PROG_JN1_L_BUF
PROG_JN2_L: U21.7(2Y2) ; port PROG_JN2_L
PROG_JN2_L_BUF: U16.P9.12(GPIO_60) U21.13(2A2) ; off-sheet PROG_JN2_L_BUF
PROG_JN3_L_BUF: U16.P9.27(GPIO_125) U21.15(2A3) ; off-sheet PROG_JN3_L_BUF
RST_BBB_SYS_L: U20.12(1Y4) ; port RST_BBB_SYS_L
RST_BBB_SYS_L_BUF: S2.1 S2.3 U16.P9.10(SYS_RESET~{N}) U20.8(1A4) ; off-sheet RST_BBB_SYS_L_BUF
RST_JN1_L: U21.18(1Y1) ; port RST_JN1_L
RST_JN1_L_BUF: U16.P9.15(GPIO_48) U21.2(1A1) ; off-sheet RST_JN1_L_BUF
RST_JN2_L: U21.16(1Y2) ; port RST_JN2_L
RST_JN2_L_BUF: U16.P9.14(GPIO_40) U21.4(1A2) ; off-sheet RST_JN2_L_BUF
RST_JN3_L_BUF: U16.P9.23(GPIO_49) U21.6(1A3) ; off-sheet RST_JN3_L_BUF
UART1-BBB-RXD_JN3_BUF: U16.P9.26(GPIO_14) U20.5(2Y3) ; off-sheet UART1-BBB-RXD_JN3_BUF
UART1-BBB-TXD_JN3_BUF: U16.P9.24(GPIO_15) U20.6(1A3) ; off-sheet UART1-BBB-TXD_JN3_BUF
UART2-BBB-RXD_JN1_BUF: U16.P9.22(GPIO_2) U20.9(2Y1) ; off-sheet UART2-BBB-RXD_JN1_BUF
UART2-BBB-TXD_JN1_BUF: U16.P9.21(GPIO_3) U20.2(1A1) ; off-sheet UART2-BBB-TXD_JN1_BUF
UART4-BBB-RXD_JN2_BUF: U16.P9.11(GPIO_30) U20.7(2Y2) ; off-sheet UART4-BBB-RXD_JN2_BUF
UART4-BBB-TXD_JN2_BUF: U16.P9.13(GPIO_31) U20.4(1A2) ; off-sheet UART4-BBB-TXD_JN2_BUF
UART5-BBB-RX_PIC_BUF: U16.P8.38(GPIO_79) U22.18(1Y1) ; off-sheet UART5-BBB-RX_PIC_BUF
UART5-BBB-TX_PIC_BUF: U16.P8.37(GPIO_78) U22.4(1A2) ; off-sheet UART5-BBB-TX_PIC_BUF
UART_JN1_RXD0: U20.18(1Y1) ; port UART_JN1_RXD0
UART_JN1_TXD0: U20.11(2A1) ; port UART_JN1_TXD0
UART_JN2_RXD0: U20.16(1Y2) ; port UART_JN2_RXD0
UART_JN2_TXD0: U20.13(2A2) ; port UART_JN2_TXD0
NetU20_14: U20.14(1Y3) ; port UART_JN3_RXD0
NetU20_15: U20.15(2A3) ; port UART_JN3_TXD0
NetU21_5: U21.5(2Y3) ; port PROG_JN3_L
NetU21_14: U21.14(1Y3) ; port RST_JN3_L
NetU22_5: U22.5(2Y3) ; port LED_FAULT
NetU22_7: U22.7(2Y2) ; port LED_NET_OK
NetU22_9: U22.9(2Y1) ; port LED_BBB_OK

Not connected (* = marked no-connect by the designer): U2 1(NC); U16 J1.2(NC)* J1.3(NC)* J1.6(NC)* P8.3(GPIO_38) P8.4(GPIO_39) P8.5(GPIO_34) P8.6(GPIO_35) P8.9(GPIO_69) P8.10(GPIO_68) P8.11(GPIO_45) P8.12(GPIO_44) P8.14(GPIO_26) P8.15(GPIO_47) P8.16(GPIO_46) P8.17(GPIO_27) P8.18(GPIO_65) P8.20(GPIO_63) P8.21(GPIO_62) P8.22(GPIO_37) P8.23(GPIO_36) P8.24(GPIO_33) P8.25(GPIO_32) P8.26(GPIO_61) P8.27(GPIO_86) P8.28(GPIO_88) P8.29(GPIO_87) P8.30(GPIO_89) P8.31(GPIO_10) P8.32(GPIO_11) P8.33(GPIO_9) P8.34(GPIO_81) P8.35(GPIO_8) P8.36(GPIO_80) P8.39(GPIO_76) P8.40(GPIO_77) P8.41(GPIO_74) P8.42(GPIO_75) P8.43(GPIO_72) P8.44(GPIO_73) P8.45(GPIO_70) P8.46(GPIO_71) P9.7(SYS_5V) P9.8(SYS_5V) P9.9(PWR_BUT) P9.17(GPIO_4) P9.18(GPIO_5) P9.25(GPIO_117) P9.28(GPIO_123) P9.29(GPIO_121) P9.30(GPIO_122) P9.31(GPIO_120) P9.32(VDD_ADC) P9.33(AIN4) P9.34(GNDA_ADC) P9.35(AIN6) P9.36(AIN5) P9.37(AIN2) P9.38(AIN3) P9.39(AIN0) P9.40(AIN1) P9.41(GPIO_20) P9.42(GPIO_7); U21 3(2Y4) 8(1A4) 12(1Y4) 17(2A4); U22 3(2Y4) 6(1A3) 8(1A4) 12(1Y4) 14(1Y3) 17(2A4)

### Notes on the sheet
- DALI PHY Block
- Rev 1.0
- (near U20) 3 State Buffers
- (near U16) BBB Header
- (near U16) Check BoM Manual Entry
- Title:
- Sheet:
- Date:
- of
- Project:
- Revision:
- Engineer:
- Wi4B S.r.l
- (in symbol BEAGLE_BONE_BLACK_CAPE, part A) P8

### Library data of the parts
C1 C20 C21 C45 = CL05B104KO3LNNC: CAP CER 0.1UF 16V X7R 0402; MFT: Samsung Electro-Mechanics America, Inc.; RATING: ±10%, 16V; TYPE: Surface Mount, MLCC; FUNCTION: BBB; MPN: CL05B104KO3LNNC
S2 = KMR231GLFS: SWITCH TACTILE SPST-NO 0.05A 32V; MFT: C&K Components; FUNCTION: BBB; VALUE: KMR231GLFS; TYPE: SMD; MPN: KMR231GLFS
U2 = NC7S04M5X: IC INVERTER HS SINGLE SOT-23-5; MFT: ON Semiconductor; FUNCTION: BBB; LOAD: *; RATING: *; TYPE: SMD; VALUE: NC7S04M5X; MPN: NC7S04M5X
U16 = BEAGLE_BONE_BLACK_CAPE: Beaglebone 2x23 Pin stacking header(2 Pack ); MFT: Microrobotics; VALUE: BB-2X23; FUNCTION: BBB; TYPE: SMD; RATING: *; LOAD: *
U20-U22 = SN74LVC244APWR: IC BUFF/DVR TRI-ST DUAL 20TSSOP; MFT: Texas Instruments; FUNCTION: BBB; MPN: SN74LVC244APWR; TYPE: SMD; RATING: *; LOAD: *; VALUE: SN74LVC244APWR

## Sheet USB_Mini.SchDoc
size A4; Engineer: JBayalas; DocumentNumber: 8; Revision: V1.1; SheetNumber: 8; SheetTotal: 13
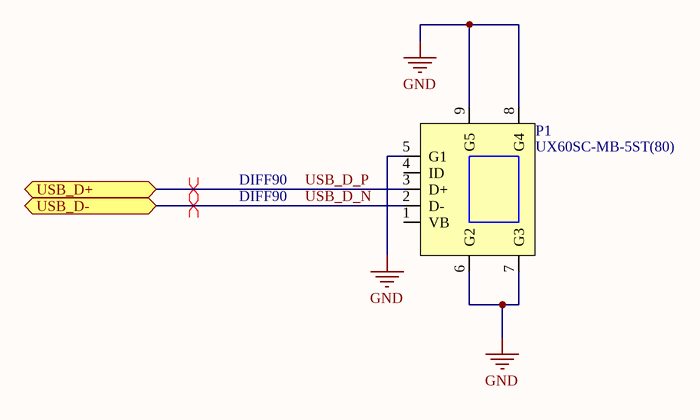
[diagram p5: USB_Mini.SchDoc]

### Parts
P1  *  [UX60SC-MB-5ST(80)]  (value not drawn)

### Ports
USB_D+ (bidir), USB_D- (bidir)

### Nets
GND: P1.5(G1) P1.6(G2) P1.7(G3) P1.8(G4) P1.9(G5)
USB_D_N: P1.2(D-) ; port USB_D-
USB_D_P: P1.3(D+) ; port USB_D+

Not connected (* = marked no-connect by the designer): P1 1(VB) 4(ID)

### Layout directives
differential pair; net class DIFF90: USB_D_N, USB_D_P

### Notes on the sheet
- Title:
- Sheet:
- Date:
- of
- Project:
- Revision:
- Engineer:
- Wi4B S.r.l

### Library data of the parts
P1 = UX60SC-MB-5ST(80): CONN RCPT USB MINI B R/A SMD; MFT: Hirose Electric Co Ltd; VALUE: UX60SC-MB-5ST(80); TYPE: SMD; RATING: *; LOAD: *; MPN: UX60SC-MB-5ST(80); FUNCTION: USB

## Sheet pic_blk.SchDoc
size A4; Engineer: JBayalas; DocumentNumber: 11; Revision: V1.1; SheetNumber: 11; SheetTotal: 13
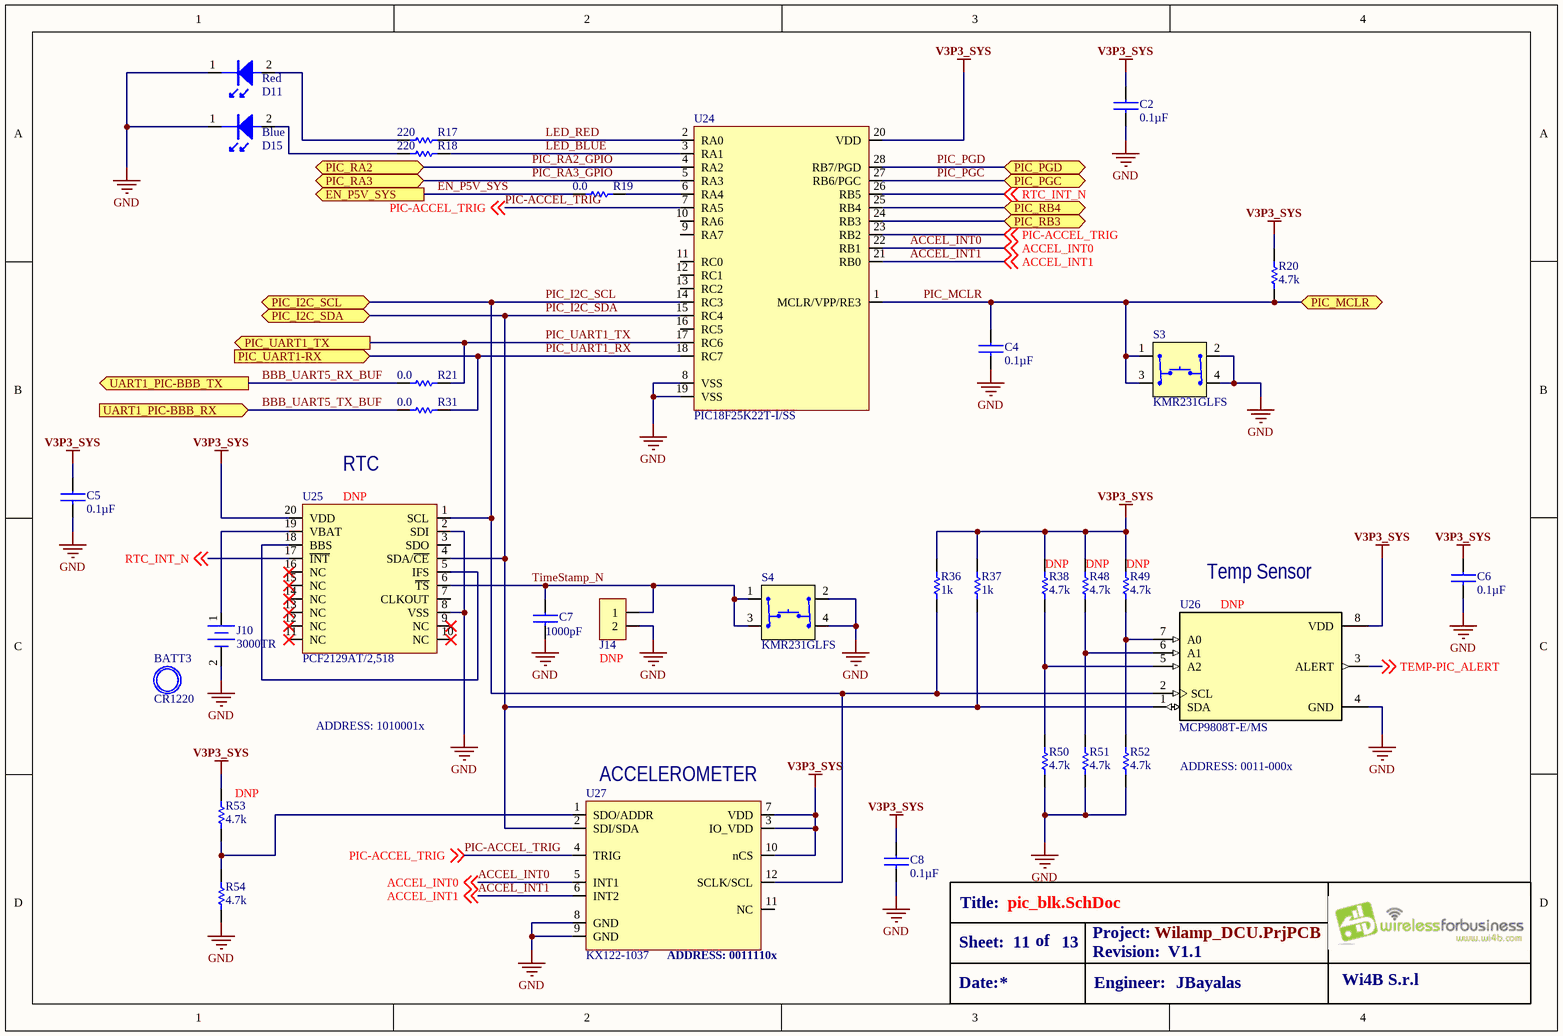
[diagram p6: pic_blk.SchDoc]

### Parts
BATT3  CR1220
C2  value 0.1µF  [C0402]  (hidden comment: *)
C4  value 0.1µF  [C0402]  (hidden comment: *)
C5  value 0.1µF  [C0402]  (hidden comment: *)
C6  value 0.1µF  [C0402]  (hidden comment: *)
C7  value 1000pF  [C0402]  (hidden comment: *)
C8  value 0.1µF  [C0402]  (hidden comment: *)
D11  value Red  [LED0402(RED)]  (hidden comment: *)
D15  value Blue  [LED0402(BLUE)]  (hidden comment: *)
J10  3000TR  [3000TR]
J14  LOAD: DNP  [2pin 5mm Pitch]  (hidden comment: *)
R17  value 220  [R0402]  (hidden comment: *)
R18  value 220  [R0402]  (hidden comment: *)
R19  value 0.0  [R0402]  (hidden comment: *)
R20  value 4.7k  [R0603]  (hidden comment: *)
R21  value 0.0  [R0402]  (hidden comment: *)
R31  value 0.0  [R0402]  (hidden comment: *)
R36  value 1k  [R0402]  (hidden comment: *)
R37  value 1k  [R0402]  (hidden comment: *)
R38  value 4.7k  LOAD: DNP  [R0402]  (hidden comment: *)
R48  value 4.7k  LOAD: DNP  [R0402]  (hidden comment: *)
R49  value 4.7k  LOAD: DNP  [R0402]  (hidden comment: *)
R50  value 4.7k  [R0402]  (hidden comment: *)
R51  value 4.7k  [R0402]  (hidden comment: *)
R52  value 4.7k  [R0402]  (hidden comment: *)
R53  value 4.7k  LOAD: DNP  [R0402]  (hidden comment: *)
R54  value 4.7k  [R0402]  (hidden comment: *)
S3  *  [KMR231G ULC LFS]  (value not drawn)
S4  *  [KMR231G ULC LFS]  (value not drawn)
U24  value PIC18F25K22T-I/SS  [SSOP-28 (PIC)]  (hidden comment: *)
U25  value PCF2129AT/2,518  LOAD: DNP  [SOIC-20]  (hidden comment: *)
U26  LOAD: DNP  [SOP65P490X110-8N]  (hidden comment: MCP9808T-E/MS)
U27  *  [KX122-1037]  (value not drawn)

### Ports
EN_P5V_SYS (out), PIC_I2C_SCL (bidir), PIC_I2C_SDA (bidir), PIC_MCLR (bidir), PIC_PGC (bidir), PIC_PGD (bidir), PIC_RA2 (bidir), PIC_RA3 (bidir), PIC_RB3 (bidir), PIC_RB4 (bidir), PIC_UART1-RX (in), PIC_UART1_TX (out), UART1_PIC-BBB_RX (in), UART1_PIC-BBB_TX (out)

### Nets
GND: C2.2 C4.2 C5.2 C6.2 C7.2 C8.2 D11.1 D15.1 J10.2(-) J14.2 R50.1 R51.1 R52.1 R54.1 S3.2 S3.4 S4.2 S4.4 U24.8(VSS) U24.19(VSS) U25.2(SDI) U25.8(VSS) U26.4(GND) U27.8(GND) U27.9(GND)
V3P3_SYS: C2.1 C5.1 C6.1 C8.1 R20.2 R36.2 R37.2 R38.2 R48.2 R49.2 R53.2 U24.20(VDD) U25.20(VDD) U26.8(VDD) U27.3(IO_VDD) U27.7(VDD) U27.10(nCS)
ACCEL_INT0: U24.22(RB1) U27.5(INT1) ; off-sheet ACCEL_INT0
ACCEL_INT1: U24.21(RB0) U27.6(INT2) ; off-sheet ACCEL_INT1
BBB_UART5_RX_BUF: R21.2 ; port UART1_PIC-BBB_TX
BBB_UART5_TX_BUF: R31.2 ; port UART1_PIC-BBB_RX
EN_P5V_SYS: R19.2 ; port EN_P5V_SYS
LED_BLUE: R18.2 U24.3(RA1)
LED_RED: R17.2 U24.2(RA0)
PIC-ACCEL_TRIG: U24.7(RA5) U24.23(RB2) U27.4(TRIG) ; off-sheet PIC-ACCEL_TRIG
PIC_GPIO_C: U24.25(RB4) ; port PIC_RB4
PIC_GPIO_D: U24.24(RB3) ; port PIC_RB3
PIC_I2C_SCL: R36.1 U24.14(RC3) U25.1(SCL) U26.2(SCL) U27.12(SCLK/SCL) ; port PIC_I2C_SCL
PIC_I2C_SDA: R37.1 U24.15(RC4) U25.4(SDA/~{CE}) U26.1(SDA) U27.2(SDI/SDA) ; port PIC_I2C_SDA
PIC_MCLR: C4.1 R20.1 S3.1 S3.3 U24.1(MCLR/VPP/RE3) ; port PIC_MCLR
PIC_PGC: U24.27(RB6/PGC) ; port PIC_PGC  [project net PIC_ICSP_CLK]
PIC_PGD: U24.28(RB7/PGD) ; port PIC_PGD  [project net PIC_ICSP_DAT]
PIC_RA2_GPIO: U24.4(RA2) ; port PIC_RA2  [project net PIC_GPIO_A]
PIC_RA3_GPIO: U24.5(RA3) ; port PIC_RA3  [project net PIC_GPIO_B]
PIC_UART1_RX: R31.1 U24.18(RC7) ; port PIC_UART1-RX
PIC_UART1_TX: R21.1 U24.17(RC6) ; port PIC_UART1_TX
RTC_INT_N: U24.26(RB5) U25.17(~{INT}) ; off-sheet RTC_INT_N
TEMP-PIC_ALERT: U26.3(ALERT) ; off-sheet TEMP-PIC_ALERT
TimeStamp_N: C7.1 J14.1 S4.1 S4.3 U25.6(~{TS})
NetD11_2: D11.2 R17.1
NetD15_2: D15.2 R18.1
NetJ10_1: J10.1(+) U25.19(VBAT)
NetR19_1: R19.1 U24.6(RA4)
NetR38_1: R38.1 R50.2 U26.5(A2)
NetR48_1: R48.1 R51.2 U26.6(A1)
NetR49_1: R49.1 R52.2 U26.7(A0)
NetR53_1: R53.1 R54.2 U27.1(SDO/ADDR)
NetU25_5: U25.5(IFS) U25.18(BBS)

Not connected (* = marked no-connect by the designer): U24 9(RA7) 10(RA6) 11(RC0) 12(RC1) 13(RC2) 16(RC5); U25 3(SDO) 7(CLKOUT) 9(NC)* 10(NC)* 11(NC)* 12(NC)* 13(NC)* 14(NC)* 15(NC)* 16(NC)*; U27 11(NC)

### Notes on the sheet
- RTC
- (near U26) Temp Sensor
- ADDRESS: 1010001x
- (near U27) ACCELEROMETER
- ADDRESS: 0011-000x
- (near U27) ADDRESS: 0011110x
- Title:
- Sheet:
- Date:
- of
- Project:
- Revision:
- Engineer:
- Wi4B S.r.l

### Library data of the parts
BATT3 = CR1220: Coin Cell Battery 35mAh 12.5mm; MFT: FDK; RATING: 3V, 35mAh; FUNCTION: PIC; TYPE: SMD; LOAD: *; VALUE: CR1220; MPN: CR1220
C2 C4-C6 C8 = CL05B104KO3LNNC: CAP CER 0.1UF 16V X7R 0402; MFT: Samsung Electro-Mechanics America, Inc.; RATING: ±10%, 16V; TYPE: Surface Mount, MLCC; FUNCTION: PIC; MPN: CL05B104KO3LNNC
C7 = GRM155R71H102KA01D: CAP CER 1000PF 50V X7R 0402; MFT: Murata Electronics North America; TYPE: SMD; FUNCTION: PIC; MPN: GRM155R71H102KA01D; LOAD: *; RATING: 50V
D11 = LNJ247W82RA: LED RED 0402 SMD; MFT: Panasonic Electronic Components; TYPE: Surface Mount; FUNCTION: PIC; MPN: LNJ247W82RA
D15 = VLMB1500-GS08: LED BLUE 0402 SMD; MFT: Vishay Semiconductor Opto Division; FUNCTION: PIC; MPN: VLMB1500-GS08; TYPE: SMD; RATING: *; LOAD: *
J10 = 3000TR: Coin Cell Battery Holders SM COIN CELL B/H; MFT: Keystone Electronics; FUNCTION: PIC; MPN: 3000TR; TYPE: SMD; RATING: *; LOAD: *; VALUE: 3000TR
J14 = 2PIN Signal 5mm Pitch: FUNCTION: PIC
R17 R18 = RC0402JR-07220RL: RES SMD 220 OHM 5% 1/16W 0402; MFT: Yageo; FUNCTION: PIC; MPN: RC0402JR-07220RL; RATING: *; TYPE: SMD; LOAD: *
R19 R21 R31 = CRCW04020000Z0ED: RES SMD 0.0OHM JUMPER 1/16W 0402; MFT: Vishay Dale; RATING: 63mW; FUNCTION: PIC; MPN: CRCW04020000Z0ED; TYPE: Surface Mount
R20 = ERA-3AEB472V: RES SMD 4.7K OHM 0.1% 1/10W 0603; MFT: Panasonic; FUNCTION: PIC; MPN: ERA-3AEB472V; LOAD: *; RATING: 1/10W; TYPE: SMD
R36 R37 = MCS04020C1001FE000: RES SMD 1K OHM 1% 1/10W 0402; MFT: Vishay Beyschlag; FUNCTION: PIC; MPN: MCS04020C1001FE000; TYPE: SMD; RATING: 1/10W; LOAD: *
R38 R48-R54 = RC0402JR-074K7L: RES SMD 4.7K OHM 5% 1/16W 0402; MFT: Yageo; FUNCTION: PIC; MPN: RC0402JR-074K7L; RATING: ±5%; TYPE: Surface Mount
S3 S4 = KMR231GLFS: SWITCH TACTILE SPST-NO 0.05A 32V; MFT: C&K Components; FUNCTION: PIC; VALUE: KMR231GLFS; TYPE: SMD; MPN: KMR231GLFS
U24 = PIC18F25K22T-I/SS: MCU 8BIT 32KB FLASH 28SSOP; MFT: Microchip; FUNCTION: PIC; MPN: PIC18F25K22T-I/SS; TYPE: SMD; RATING: *; LOAD: *
U25 = PCF2129AT/2,518: IC RTC /CALENDAR TCXO QTZ 20SOIC; MFT: NXP Semiconductors; FUNCTION: PIC; MPN: PCF2129AT/2,518; TYPE: SMD; RATING: *
U26 = MCP9808T-E/MS: MCP9808 Series 3.6 V Memory Module Digital Temperature Sensor SMT - MSOP-8; MFT: Microchip; FUNCTION: PIC; MPN: MCP9808T-E/MS; TYPE: SMD; RATING: *; VALUE: MCP9808T-E/MS
U27 = KX122-1037: ACCELEROMETER 2-8G I2C/SPI 12LGA; MFT: Kionix Inc.; FUNCTION: PIC; LOAD: *; RATING: *; TYPE: SMD; VALUE: KX122-1037; MPN: KX122-1037

## Nets that join several sheets
GND: top_dsn (J15.2 J15.3), JN1 (11 pins), JN2 (11 pins), crypto_blk (35 pins), bbb_blk (19 pins), USB_Mini (5 pins), pic_blk (25 pins)
V3P3_BBB: crypto_blk (30 pins), bbb_blk (11 pins)
V3P3_SYS: JN1 (9 pins), JN2 (9 pins), pic_blk (17 pins)
BBB_UART5_RX_BUF: bbb_blk (U22.2), pic_blk (R21.2)
BBB_UART5_TX_BUF: bbb_blk (U22.16), pic_blk (R31.2)
CRYPTO_AUTH0: crypto_blk (R61.2 U10.2), bbb_blk (U20.17)
I2C_CRYPTO_SCL: crypto_blk (9 pins), bbb_blk (U16.P9.19)
I2C_CRYPTO_SDA: crypto_blk (9 pins), bbb_blk (U16.P9.20)
PROG_JN1_L: JN1 (D3_JN1.1 J2_JN1.5), bbb_blk (U21.9)
PROG_JN2_L: JN2 (D3_JN2.1 J2_JN2.5), bbb_blk (U21.7)
RST_BBB_SYS_L: crypto_blk (R60.1 U17.16), bbb_blk (U20.12)
RST_JN1_L: JN1 (C10_JN1.1 J2_JN1.7 R12_JN1.1), bbb_blk (U21.18)
RST_JN2_L: JN2 (C10_JN2.1 J2_JN2.7 R12_JN2.1), bbb_blk (U21.16)
UART_JN1_RXD0: JN1 (J2_JN1.1), bbb_blk (U20.18)
UART_JN1_TXD0: JN1 (J2_JN1.3), bbb_blk (U20.11)
UART_JN2_RXD0: JN2 (J2_JN2.1), bbb_blk (U20.16)
UART_JN2_TXD0: JN2 (J2_JN2.3), bbb_blk (U20.13)

## Assembly variants
Variant of WiLamp(Proto): not fitted C7 C13 C19 C20 D2 D10 D11 FB1 Q1 Q2 R19 R21 R22 R23 R24 R25 R26 R27 R28 R29 R38 R39 R40 R41 R42 U5 U6